# EAGLE design NAV_Doska_2 (EAGLE 7.2.0)
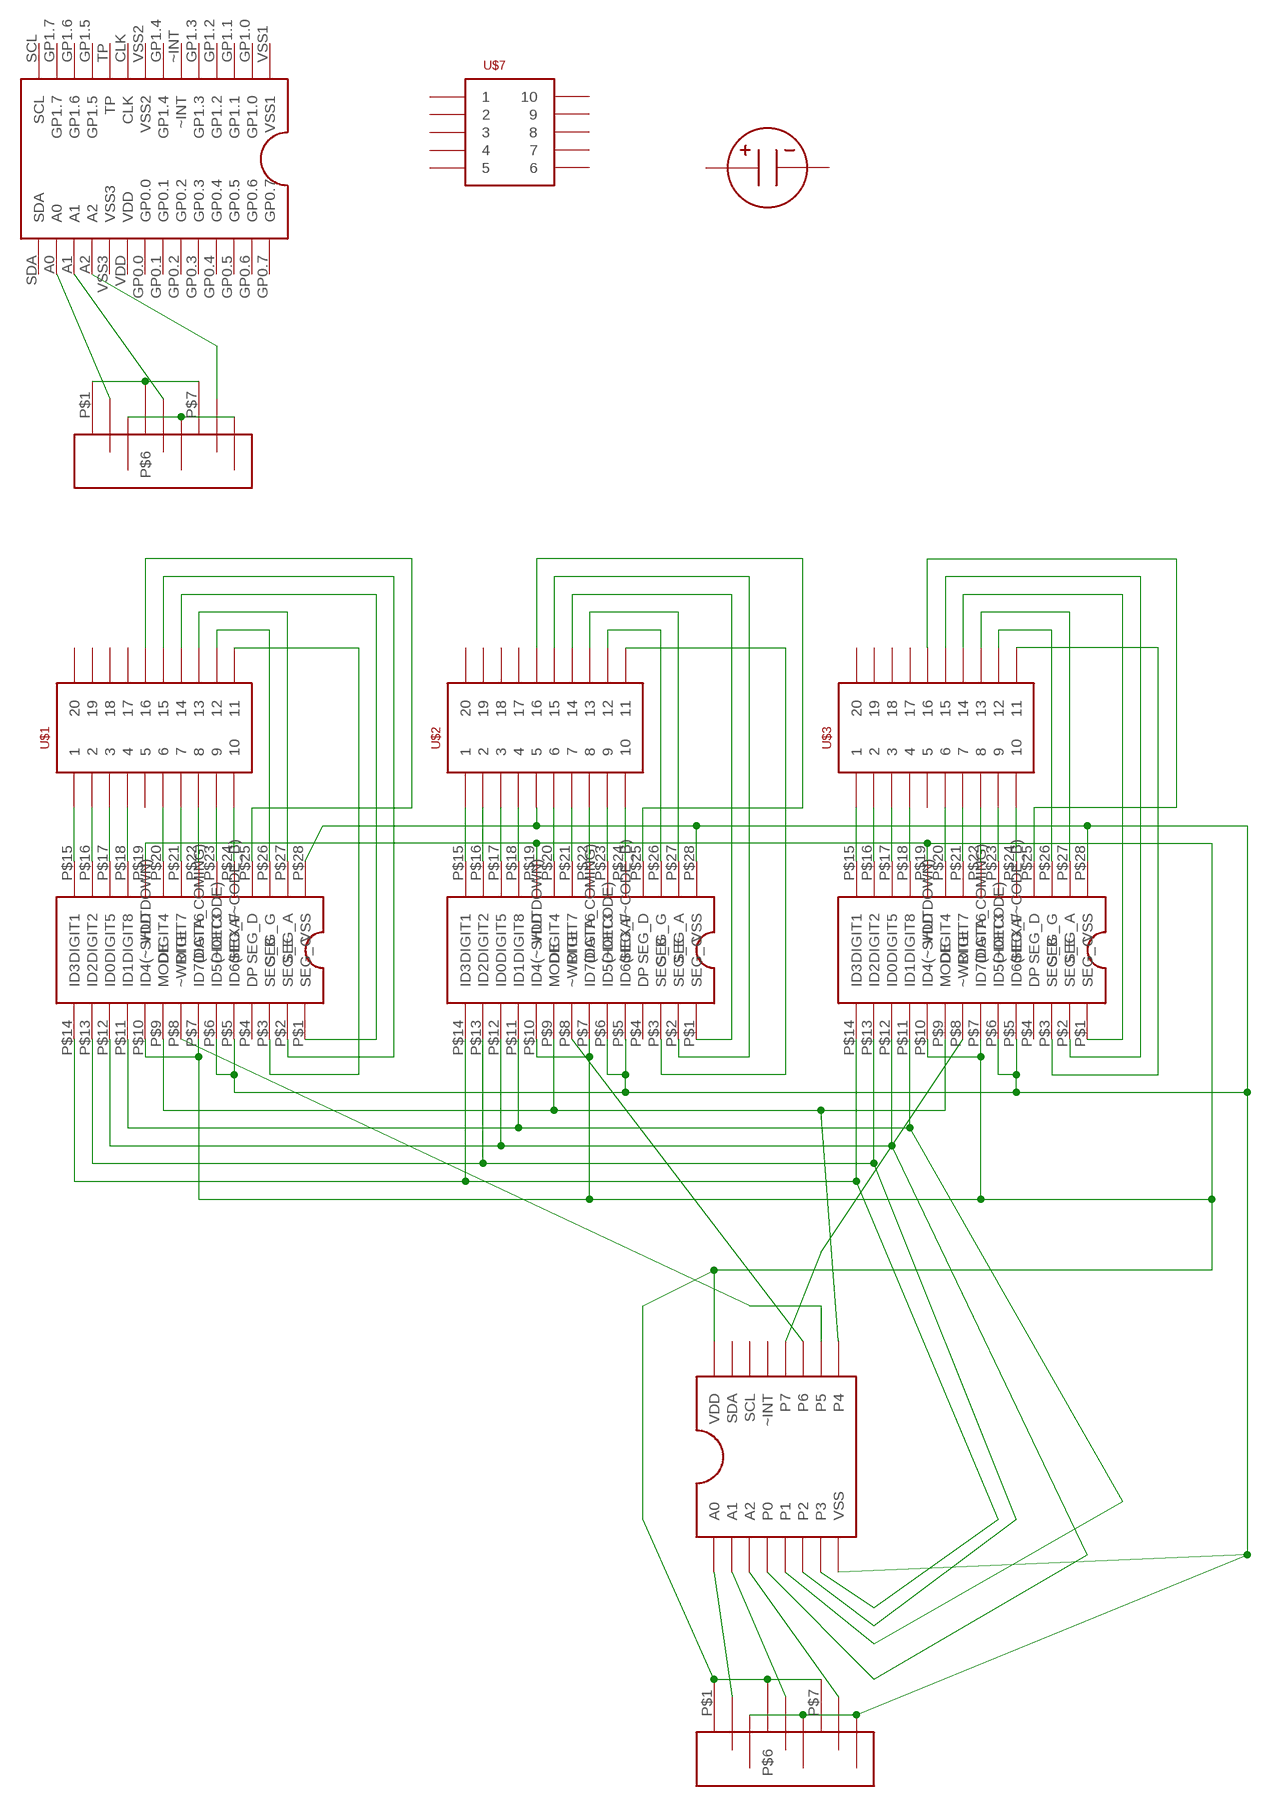
[diagram p0: schematic, sheet 1]

## Parts
U$1  LISTA_2X10  [LISTA_2X10]
U$2  LISTA_2X10  [LISTA_2X10]
U$3  LISTA_2X10  [LISTA_2X10]
U$4  ICM7228A  [ICM7228A]
U$5  ICM7228A  [ICM7228A]
U$6  ICM7228A  [ICM7228A]
U$7  LISTA_2X5  [LISTA_2X5]
U$8  MCP23016  [MCP23016]
U$9  PCF8574A  [PCF8574A]
U$10  ADRESA_0..2  [ADRESA_0..2]
U$11  ADRESA_0..2  [ADRESA_0..2]
U$12  KONDENZATOR_  [KONDENZATOR_]

## Nets
GND: U$2.5 U$4.P$5(ID6(HEXA/~CODE_B)) U$4.P$6(ID5(~DECODE)) U$4.P$28(VSS) U$5.P$5(ID6(HEXA/~CODE_B)) U$5.P$6(ID5(~DECODE)) U$5.P$28(VSS) U$6.P$5(ID6(HEXA/~CODE_B)) U$6.P$6(ID5(~DECODE)) U$6.P$28(VSS) U$9.VSS U$11.P$3 U$11.P$4 U$11.P$9
N$1: U$1.1 U$4.P$15(DIGIT1)
N$2: U$2.1 U$5.P$15(DIGIT1)
N$3: U$1.2 U$4.P$16(DIGIT2)
N$4: U$1.3 U$4.P$17(DIGIT5)
N$5: U$1.4 U$4.P$18(DIGIT8)
N$6: U$1.11 U$4.P$3(SEG_B)
N$7: U$1.6 U$4.P$20(DIGIT4)
N$8: U$1.7 U$4.P$21(DIGIT7)
N$9: U$1.8 U$4.P$22(DIGIT6)
N$10: U$1.9 U$4.P$23(DIGIT3)
N$11: U$1.10 U$4.P$24(SEG_F)
N$12: U$1.12 U$4.P$26(SEG_G)
N$13: U$1.13 U$4.P$27(SEG_A)
N$14: U$2.2 U$5.P$16(DIGIT2)
N$15: U$2.3 U$5.P$17(DIGIT5)
N$16: U$2.4 U$5.P$18(DIGIT8)
N$17: U$3.1 U$6.P$15(DIGIT1)
N$18: U$2.6 U$5.P$20(DIGIT4)
N$19: U$2.7 U$5.P$21(DIGIT7)
N$20: U$2.8 U$5.P$22(DIGIT6)
N$21: U$2.9 U$5.P$23(DIGIT3)
N$22: U$2.10 U$5.P$24(SEG_F)
N$23: U$3.2 U$6.P$16(DIGIT2)
N$24: U$3.3 U$6.P$17(DIGIT5)
N$25: U$3.4 U$6.P$18(DIGIT8)
N$26: U$3.6 U$6.P$20(DIGIT4)
N$27: U$3.7 U$6.P$21(DIGIT7)
N$28: U$3.8 U$6.P$22(DIGIT6)
N$29: U$3.9 U$6.P$23(DIGIT3)
N$30: U$3.10 U$6.P$24(SEG_F)
N$31: U$2.16 U$5.P$25(SEG_D)
N$32: U$2.12 U$5.P$26(SEG_G)
N$33: U$2.13 U$5.P$27(SEG_A)
N$34: U$3.16 U$6.P$25(SEG_D)
N$35: U$3.12 U$6.P$26(SEG_G)
N$36: U$3.13 U$6.P$27(SEG_A)
N$37: U$1.14 U$4.P$1(SEG_C)
N$38: U$1.15 U$4.P$2(SEG_E)
N$39: U$1.16 U$4.P$25(SEG_D)
N$40: U$4.P$14(ID3) U$5.P$14(ID3) U$6.P$14(ID3) U$9.P3
N$41: U$4.P$13(ID2) U$5.P$13(ID2) U$6.P$13(ID2) U$9.P2
N$42: U$4.P$12(ID0) U$5.P$12(ID0) U$6.P$12(ID0) U$9.P0
N$43: U$4.P$11(ID1) U$5.P$11(ID1) U$6.P$11(ID1) U$9.P1
N$44: U$4.P$9(MODE) U$5.P$9(MODE) U$6.P$9(MODE) U$9.P4
N$45: U$2.14 U$5.P$1(SEG_C)
N$46: U$2.15 U$5.P$2(SEG_E)
N$47: U$9.A0 U$11.P$2
N$48: U$3.14 U$6.P$1(SEG_C)
N$49: U$3.15 U$6.P$2(SEG_E)
N$50: U$9.A1 U$11.P$5
N$52: U$3.11 U$6.P$3(SEG_B)
N$53: U$2.11 U$5.P$3(SEG_B)
N$54: U$10.P$3 U$10.P$4 U$10.P$9
N$55: U$9.A2 U$11.P$8
N$56: U$8.A0 U$10.P$2
N$57: U$8.A1 U$10.P$5
N$58: U$8.A2 U$10.P$8
N$59: U$10.P$1 U$10.P$6 U$10.P$7
N$60: U$6.P$8(~WRITE) U$9.P7
N$61: U$5.P$8(~WRITE) U$9.P6
N$62: U$4.P$8(~WRITE) U$9.P5
N$64: U$4.P$7(ID7(DATA_COMING)) U$4.P$10(ID4(~SHUTDOWN)) U$4.P$19(VDD) U$5.P$7(ID7(DATA_COMING)) U$5.P$10(ID4(~SHUTDOWN)) U$5.P$19(VDD) U$6.P$7(ID7(DATA_COMING)) U$6.P$10(ID4(~SHUTDOWN)) U$6.P$19(VDD) U$9.VDD U$11.P$1 U$11.P$6 U$11.P$7
Unconnected: U$1.5 U$1.17 U$1.18 U$1.19 U$1.20 U$2.17 U$2.18 U$2.19 U$2.20 U$3.5 U$3.17 U$3.18 U$3.19 U$3.20 U$4.P$4(DP) U$5.P$4(DP) U$6.P$4(DP) U$7.1 U$7.2 U$7.3 U$7.4 U$7.5 U$7.6 U$7.7 U$7.8 U$7.9 U$7.10 U$8.CLK U$8.GP0.0 U$8.GP0.1 U$8.GP0.2 U$8.GP0.3 U$8.GP0.4 U$8.GP0.5 U$8.GP0.6 U$8.GP0.7 U$8.GP1.0 U$8.GP1.1 U$8.GP1.2 U$8.GP1.3 U$8.GP1.4 U$8.GP1.5 U$8.GP1.6 U$8.GP1.7 U$8.SCL U$8.SDA U$8.TP U$8.VDD U$8.VSS1 U$8.VSS2 U$8.VSS3 U$8.~INT U$9.SCL U$9.SDA U$9.~INT U$12.P$1 U$12.P$2

## Library data of the parts
U$1-U$3 = RadioStack_v2:LISTA_2X10
U$4-U$6 = RadioStack_v2:ICM7228A
U$7 = RadioStack_v2:LISTA_2X5
U$8 = RadioStack_v2:MCP23016
U$9 = RadioStack_v2:PCF8574A
U$10 U$11 = RadioStack_v2:ADRESA_0..2
U$12 = RadioStack_v2:KONDENZATOR_

## Board
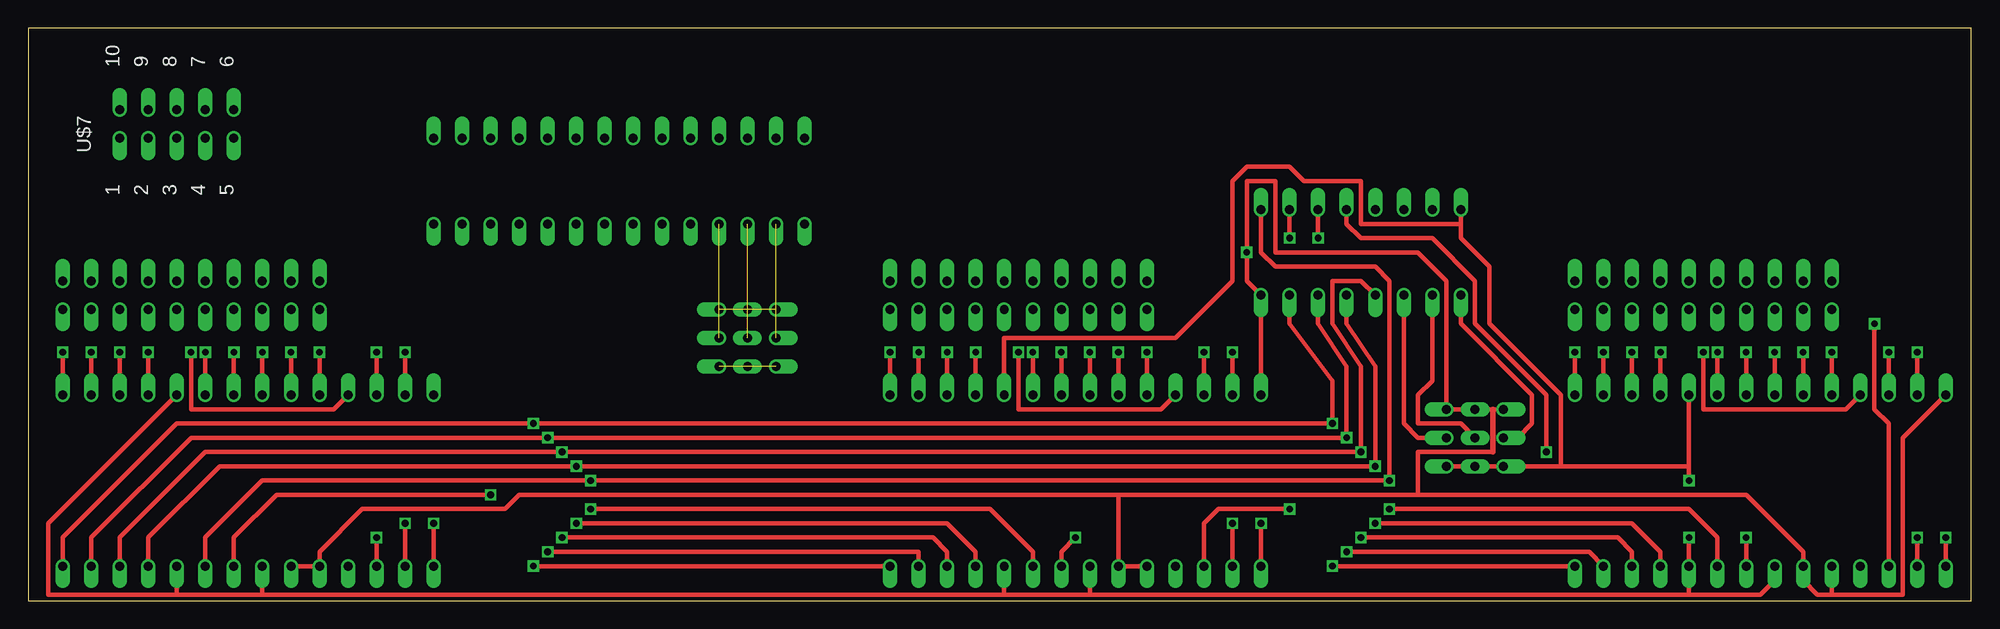
[diagram p1: board, top side]
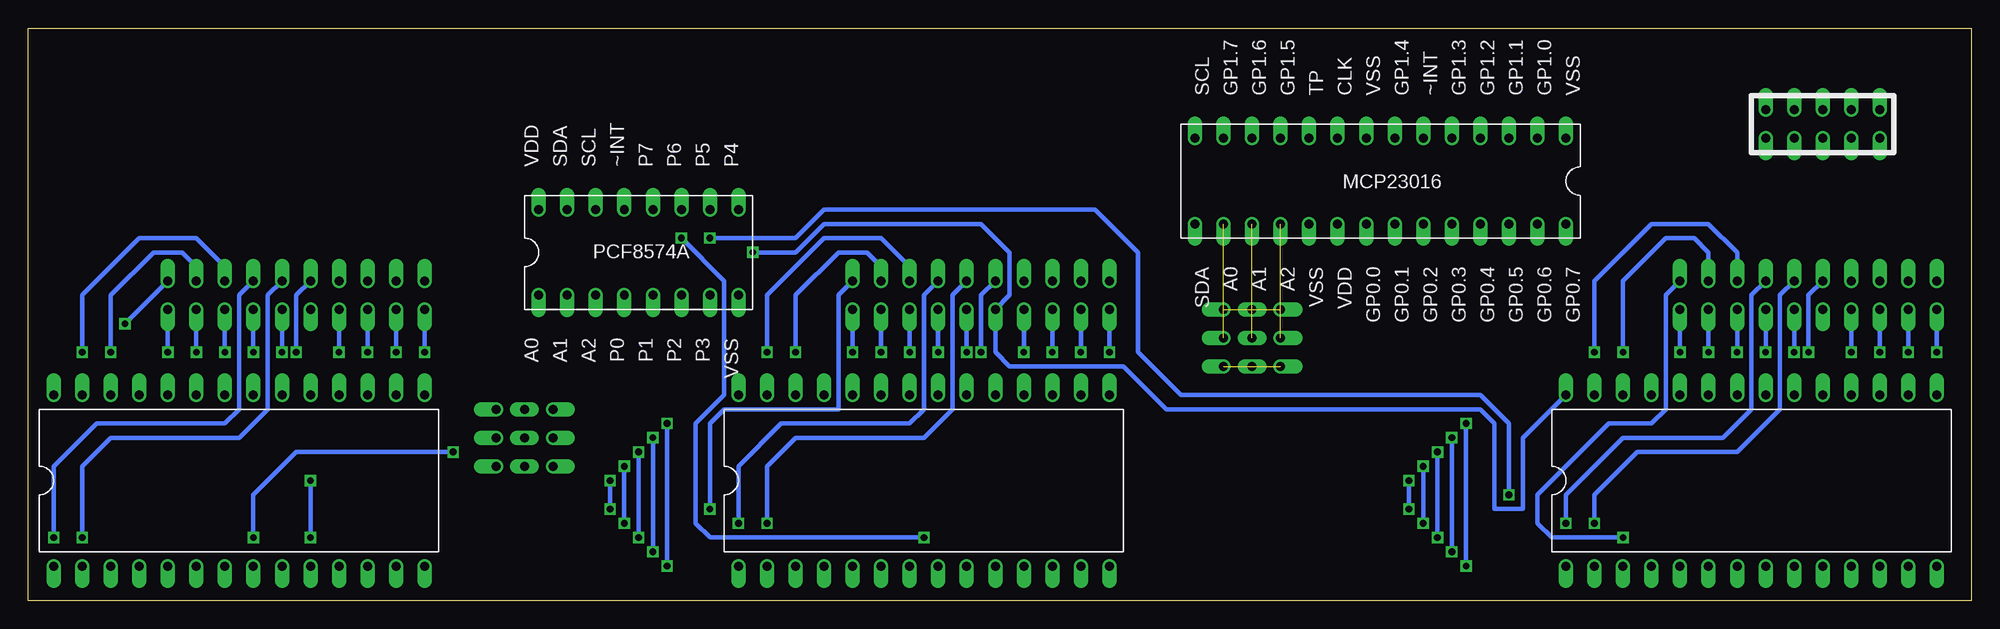
[diagram p2: board, bottom side, seen from below]

Size 173 x 51 mm. Coordinates in mm from the lower left corner, seen from the top.
Outline: 0,51 0,0 173,0 173,51 0,51
Copper layers (1*16): Top 0.035mm / dielectric 1.5mm / Bottom 0.035mm
Design rules "RadioStack_v2 *": minimum track width 0.2mm, minimum drill 0.4mm, track to track 0.2mm, track to pad 0.2mm, pad to pad 0.2mm, via to via 0.2mm, smd to smd 0.2mm, copper to edge 0.2mm, drill to drill 8mil, minimum pad ring 10mil, minimum via ring 8mil, stop-mask expansion 4mil, vias tented up to drill 0mil, thermal gap 10mil

### Footprints (pad centres in the part's own frame; a part is rotated, then mirrored left to right if it is on the bottom)
LISTA_2X10 = drill 0.8 pad 1.27 offset: 1 0,0; 2 0,-2.54; 3 0,-5.08; 4 0,-7.62; 5 0,-10.16; 6 0,-12.7; 7 0,-15.24; 8 0,-17.78; 9 0,-20.32; 10 0,-22.86; 11 2.54,-22.86; 12 2.54,-20.32; 13 2.54,-17.78; 14 2.54,-15.24; 15 2.54,-12.7; 16 2.54,-10.16; 17 2.54,-7.62; 18 2.54,-5.08; 19 2.54,-2.54; 20 2.54,0
ICM7228A = drill 0.8 pad 1.27 offset: P$1 0,0; P$2 0,-2.54 | drill 0.8 offset: P$3 0,-5.08; P$4 0,-7.62; P$5 0,-10.16; P$6 0,-12.7; P$7 0,-15.24; P$8 0,-17.78; P$9 0,-20.32; P$10 0,-22.86; P$11 0,-25.4; P$12 0,-27.94; P$13 0,-30.48; P$14 0,-33.02; P$15 15.24,-33.02; P$16 15.24,-30.48; P$17 15.24,-27.94; P$18 15.24,-25.4; P$19 15.24,-22.86; P$20 15.24,-20.32; P$21 15.24,-17.78; P$22 15.24,-15.24; P$23 15.24,-12.7; P$24 15.24,-10.16; P$25 15.24,-7.62; P$26 15.24,-5.08; P$27 15.24,-2.54; P$28 15.24,0
LISTA_2X5 = drill 0.8 pad 1.27 offset: 1 0,0; 2 0,-2.54; 3 0,-5.08; 4 0,-7.62; 5 0,-10.16; 6 2.54,-10.16; 7 2.54,-7.62; 8 2.54,-5.08; 9 2.54,-2.54; 10 2.54,0
MCP23016 = drill 0.8 pad 1.27 offset: A0 7.62,-30.48; A1 7.62,-27.94; A2 7.62,-25.4; CLK 0,-20.32; GP0.0 7.62,-17.78; GP0.1 7.62,-15.24; GP0.2 7.62,-12.7; GP0.3 7.62,-10.16; GP0.4 7.62,-7.62; GP0.5 7.62,-5.08; GP0.6 7.62,-2.54; GP0.7 7.62,0; GP1.0 0,-2.54; GP1.1 0,-5.08; GP1.2 0,-7.62; GP1.3 0,-10.16; GP1.4 0,-15.24; GP1.5 0,-25.4; GP1.6 0,-27.94; GP1.7 0,-30.48; SCL 0,-33.02; SDA 7.62,-33.02; TP 0,-22.86; VDD 7.62,-20.32; VSS1 0,0; VSS2 0,-17.78; VSS3 7.62,-22.86; ~INT 0,-12.7
PCF8574A = drill 0.8 pad 1.27 offset: A0 0,0; A1 0,-2.54; A2 0,-5.08; P0 0,-7.62; P1 0,-10.16; P2 0,-12.7; P3 0,-15.24; P4 7.62,-17.78; P5 7.62,-15.24; P6 7.62,-12.7; P7 7.62,-10.16; SCL 7.62,-5.08; SDA 7.62,-2.54; VDD 7.62,0; VSS 0,-17.78; ~INT 7.62,-7.62
ADRESA_0..2 = drill 0.8 offset: P$1 0,0; P$2 0,-2.54; P$3 0,-5.08; P$7 5.08,0; P$8 5.08,-2.54; P$9 5.08,-5.08 | drill 0.8 long: P$4 2.54,-5.08; P$5 2.54,-2.54; P$6 2.54,0
KONDENZATOR_ = drill 0.8 pad 1.27 offset: P$1 -2.54,0; P$2 2.54,0

### Placement (x,y rotation side)
U$1  3.08,25.94 90 top
U$2  76.74,25.94 90 top
U$3  137.7,25.94 90 top
U$4  36.1,3.08 90 bottom
U$5  109.76,3.08 90 bottom
U$6  170.72,3.08 90 bottom
U$7  8.16,41.18 90 top
U$8  36.1,41.18 270 bottom
U$9  127.54,27.21 90 bottom
U$10  66.58,20.86 180 top
U$11  131.35,11.97 180 top
U$12  57.69,-12.16 0 top  (outside the outline)

### Tracks (layer width: path | path; a pad name or v marks a point on that pad's centre or on a via)
GND  (via drill 0.6)
  Top 0.406: U$4.P$6 U$4.P$5 25.94,4.35 29.75,8.16 42.45,8.16 43.72,9.43 97.06,9.43 | U$5.P$5 U$5.P$6 97.06,9.43 | 97.06,9.43 123.73,9.43 | 123.73,9.43 152.94,9.43 158.02,4.35 U$6.P$6 158.02,1.81 159.29,0.54 160.56,0.54 | U$11.P$3 130.4,17.05 U$11.P$4 U$11.P$9 126.27,28.48 123.73,31.02 111.03,31.02 111.03,37.37 108.49,37.37 v108.49,31.02 108.49,28.48 U$9.VSS U$5.P$28 | 160.56,0.54 166.91,0.54 166.91,14.51 U$6.P$28 | 130.4,13.24 123.73,13.24 123.73,9.43 | U$6.P$5 160.56,0.54
  Top 0.5: 130.4,17.05 130.4,13.24
  Bottom 0.406: v108.49,31.02 104.68,31.02 102.14,33.56 88.17,33.56 85.63,31.02 85.63,27.21 U$2.5 86.9,22.13 85.63,20.86 75.47,20.86 71.66,17.05 43.72,17.05 42.45,15.78 42.45,8.16 39.91,8.16 39.91,14.51 U$4.P$28
N$1  (via drill 0.6)
  Top 0.406: v3.08,22.13 U$4.P$15
  Bottom 0.406: U$1.1 v3.08,22.13
N$2  (via drill 0.6)
  Top 0.406: U$5.P$15 v76.74,22.13
  Bottom 0.406: v76.74,22.13 U$2.1
N$3  (via drill 0.6)
  Top 0.406: v5.62,22.13 U$4.P$16
  Bottom 0.406: U$1.2 v5.62,22.13
N$4  (via drill 0.6)
  Top 0.406: v8.16,22.13 U$4.P$17
  Bottom 0.406: U$1.3 v8.16,22.13
N$5  (via drill 0.6)
  Top 0.406: v10.7,22.13 U$4.P$18
  Bottom 0.406: U$1.4 v10.7,22.13
N$6  (via drill 0.6)
  Top 0.406: U$4.P$3 v31.02,5.62
  Bottom 0.406: v31.02,5.62 37.37,5.62 38.64,6.89 38.64,9.43 32.29,15.78 28.48,15.78 27.21,17.05 27.21,27.21 U$1.11
N$7  (via drill 0.6)
  Top 0.406: v15.78,22.13 U$4.P$20
  Bottom 0.406: U$1.6 v15.78,22.13
N$8  (via drill 0.6)
  Top 0.406: v18.32,22.13 U$4.P$21
  Bottom 0.406: U$1.7 v18.32,22.13
N$9  (via drill 0.6)
  Top 0.406: v20.86,22.13 U$4.P$22
  Bottom 0.406: U$1.8 v20.86,22.13
N$10  (via drill 0.6)
  Top 0.406: v23.4,22.13 U$4.P$23
  Bottom 0.406: U$1.9 v23.4,22.13
N$11  (via drill 0.6)
  Top 0.406: v25.94,22.13 U$4.P$24
  Bottom 0.406: U$1.10 v25.94,22.13
N$12  (via drill 0.6)
  Top 0.406: U$4.P$26 v31.02,22.13
  Bottom 0.406: v31.02,22.13 31.02,28.48 27.21,32.29 24.67,32.29 23.4,31.02 U$1.12
N$13  (via drill 0.6)
  Top 0.406: U$4.P$27 v33.56,22.13
  Bottom 0.406: v33.56,22.13 33.56,28.48 28.48,33.56 23.4,33.56 20.86,31.02 U$1.13
N$14  (via drill 0.6)
  Top 0.406: U$5.P$16 v79.28,22.13
  Bottom 0.406: v79.28,22.13 U$2.2
N$15  (via drill 0.6)
  Top 0.406: U$5.P$17 v81.82,22.13
  Bottom 0.406: v81.82,22.13 U$2.3
N$16  (via drill 0.6)
  Top 0.406: U$5.P$18 v84.36,22.13
  Bottom 0.406: v84.36,22.13 U$2.4
N$17  (via drill 0.6)
  Top 0.406: U$6.P$15 v137.7,22.13
  Bottom 0.406: v137.7,22.13 U$3.1
N$18  (via drill 0.6)
  Top 0.406: U$5.P$20 v89.44,22.13
  Bottom 0.406: v89.44,22.13 U$2.6
N$19  (via drill 0.6)
  Top 0.406: U$5.P$21 v91.98,22.13
  Bottom 0.406: v91.98,22.13 U$2.7
N$20  (via drill 0.6)
  Top 0.406: U$5.P$22 v94.52,22.13
  Bottom 0.406: v94.52,22.13 U$2.8
N$21  (via drill 0.6)
  Top 0.406: U$5.P$23 v97.06,22.13
  Bottom 0.406: v97.06,22.13 U$2.9
N$22  (via drill 0.6)
  Top 0.406: U$5.P$24 v99.6,22.13
  Bottom 0.406: v99.6,22.13 U$2.10
N$23  (via drill 0.6)
  Top 0.406: U$6.P$16 v140.24,22.13
  Bottom 0.406: v140.24,22.13 U$3.2
N$24  (via drill 0.6)
  Top 0.406: U$6.P$17 v142.78,22.13
  Bottom 0.406: v142.78,22.13 U$3.3
N$25  (via drill 0.6)
  Top 0.406: U$6.P$18 v145.32,22.13
  Bottom 0.406: v145.32,22.13 U$3.4
N$26  (via drill 0.6)
  Top 0.406: U$6.P$20 v150.4,22.13
  Bottom 0.406: v150.4,22.13 U$3.6
N$27  (via drill 0.6)
  Top 0.406: U$6.P$21 v152.94,22.13
  Bottom 0.406: v152.94,22.13 U$3.7
N$28  (via drill 0.6)
  Top 0.406: U$6.P$22 v155.48,22.13
  Bottom 0.406: v155.48,22.13 U$3.8
N$29  (via drill 0.6)
  Top 0.406: U$6.P$23 v158.02,22.13
  Bottom 0.406: v158.02,22.13 U$3.9
N$30  (via drill 0.6)
  Top 0.406: U$6.P$24 v160.56,22.13
  Bottom 0.406: v160.56,22.13 U$3.10
N$31  (via drill 0.6)
  Top 0.406: U$5.P$25 100.87,17.05 88.17,17.05 v88.17,22.13
  Bottom 0.406: v88.17,22.13 88.17,27.21 U$2.16
N$32  (via drill 0.6)
  Top 0.406: U$5.P$26 v104.68,22.13
  Bottom 0.406: v104.68,22.13 104.68,27.21 100.87,31.02 98.33,31.02 97.06,29.75 U$2.12
N$33  (via drill 0.6)
  Top 0.406: U$5.P$27 v107.22,22.13
  Bottom 0.406: v107.22,22.13 107.22,27.21 102.14,32.29 97.06,32.29 94.52,29.75 U$2.13
N$34  (via drill 0.6)
  Top 0.406: U$6.P$25 161.83,17.05 149.13,17.05 v149.13,22.13
  Bottom 0.406: v149.13,22.13 149.13,27.21 U$3.16
N$35  (via drill 0.6)
  Top 0.406: U$6.P$26 v165.64,22.13
  Bottom 0.406: v165.64,22.13 165.64,27.21 161.83,31.02 159.29,31.02 158.02,29.75 U$3.12
N$36  (via drill 0.6)
  Top 0.406: U$6.P$27 v168.18,22.13
  Bottom 0.406: v168.18,22.13 168.18,27.21 163.1,32.29 158.02,32.29 155.48,29.75 U$3.13
N$37  (via drill 0.6)
  Top 0.406: U$4.P$1 v36.1,6.89
  Bottom 0.406: v36.1,6.89 36.1,9.43 31.02,14.51 22.13,14.51 19.59,17.05 19.59,27.21 U$1.14
N$38  (via drill 0.6)
  Top 0.406: U$4.P$2 v33.56,6.89
  Bottom 0.406: v33.56,6.89 33.56,9.43 29.75,13.24 20.86,13.24 17.05,17.05 17.05,27.21 U$1.15
N$39  (via drill 0.6)
  Top 0.406: U$4.P$25 27.21,17.05 14.51,17.05 v14.51,22.13
  Bottom 0.406: v14.51,22.13 14.51,27.21 U$1.16
N$40  (via drill 0.6)
  Top 0.406: U$6.P$14 v116.11,3.08 | U$4.P$14 3.08,5.62 13.24,15.78 v44.99,15.78 v116.11,15.78 116.11,19.59 112.3,24.67 U$9.P3 | v44.99,3.08 U$5.P$14
  Bottom 0.406: v44.99,15.78 v44.99,3.08 | v116.11,3.08 v116.11,15.78
N$41  (via drill 0.6)
  Top 0.406: U$6.P$13 138.97,4.35 v117.38,4.35 | U$4.P$13 5.62,5.62 14.51,14.51 v46.26,14.51 v117.38,14.51 117.38,20.86 114.84,24.67 U$9.P2 | v46.26,4.35 79.28,4.35 U$5.P$13
  Bottom 0.406: v46.26,14.51 v46.26,4.35 | v117.38,4.35 v117.38,14.51
N$42  (via drill 0.6)
  Top 0.406: U$6.P$12 142.78,4.35 141.51,5.62 v118.65,5.62 | U$4.P$12 8.16,5.62 15.78,13.24 v47.53,13.24 v118.65,13.24 118.65,20.86 116.11,24.67 116.11,28.48 118.65,28.48 U$9.P0 | v47.53,5.62 80.55,5.62 81.82,4.35 U$5.P$12
  Bottom 0.406: v47.53,13.24 v47.53,5.62 | v118.65,5.62 v118.65,13.24
N$43  (via drill 0.6)
  Top 0.406: U$6.P$11 145.32,4.35 142.78,6.89 v119.92,6.89 | U$4.P$11 10.7,5.62 17.05,11.97 v48.8,11.97 v119.92,11.97 119.92,20.86 117.38,24.67 U$9.P1 | U$5.P$11 84.36,4.35 81.82,6.89 v48.8,6.89
  Bottom 0.406: v48.8,11.97 v48.8,6.89 | v119.92,11.97 v119.92,6.89
N$44  (via drill 0.6)
  Top 0.406: U$4.P$9 15.78,5.62 20.86,10.7 v50.07,10.7 v121.19,10.7 121.19,28.48 119.92,29.75 111.03,29.75 109.76,31.02 U$9.P4 | U$5.P$9 89.44,4.35 85.63,8.16 v50.07,8.16 | U$6.P$9 150.4,5.62 147.86,8.16 v121.19,8.16
  Bottom 0.406: v121.19,8.16 v121.19,10.7 | v50.07,10.7 v50.07,8.16
N$45  (via drill 0.6)
  Top 0.406: U$5.P$1 v109.76,6.89
  Bottom 0.406: v109.76,6.89 109.76,11.97 105.95,15.78 94.52,15.78 93.25,17.05 93.25,27.21 U$2.14
N$46  (via drill 0.6)
  Top 0.406: U$5.P$2 v107.22,6.89
  Bottom 0.406: U$2.15 90.71,27.21 90.71,17.05 93.25,14.51 104.68,14.51 107.22,11.97 v107.22,6.89
N$47
  Top 0.406: U$11.P$2 132.62,14.51 133.89,15.78 133.89,18.32 127.54,24.67 U$9.A0
N$48  (via drill 0.6)
  Top 0.406: U$6.P$1 v170.72,5.62
  Bottom 0.406: U$3.14 154.21,27.21 154.21,17.05 155.48,15.78 166.91,15.78 170.72,11.97 v170.72,5.62
N$49  (via drill 0.6)
  Top 0.406: U$6.P$2 v168.18,5.62
  Bottom 0.406: U$3.15 151.67,27.21 151.67,17.05 154.21,14.51 165.64,14.51 168.18,11.97 v168.18,5.62
N$50
  Top 0.406: U$11.P$5 127.54,15.78 123.73,15.78 123.73,18.32 125,19.59 U$9.A1
N$52  (via drill 0.6)
  Top 0.406: U$6.P$3 165.64,15.78 164.37,17.05 v164.37,24.67
  Bottom 0.406: v164.37,24.67 U$3.11
N$53  (via drill 0.6)
  Top 0.406: U$5.P$3 104.68,6.89 105.95,8.16 v112.3,8.16
  Bottom 0.406: v112.3,8.16 112.3,15.78 111.03,17.05 100.87,17.05 100.87,27.21 U$2.11
N$54  (2 unrouted)
N$55
  Top 0.406: U$9.A2 122.46,15.78 123.73,14.51 U$11.P$8
N$56  (1 unrouted)
N$57  (1 unrouted)
N$58  (1 unrouted)
N$59  (2 unrouted)
N$60  (via drill 0.6)
  Top 0.406: U$6.P$8 v152.94,5.62 | v135.16,13.24 135.16,18.32 128.81,24.67 128.81,28.48 125,32.29 118.65,32.29 117.38,33.56 U$9.P7
  Bottom 0.406: v152.94,5.62 152.94,9.43 149.13,13.24 v135.16,13.24
N$61  (via drill 0.6)
  Top 0.406: U$5.P$8 91.98,4.35 v93.25,5.62 | v114.84,32.29 U$9.P6
  Bottom 0.406: v93.25,5.62 112.3,5.62 113.57,6.89 113.57,15.78 111.03,18.32 111.03,28.48 v114.84,32.29
N$62  (via drill 0.6)
  Top 0.406: U$4.P$8 18.32,5.62 22.13,9.43 v41.18,9.43 | v112.3,32.29 U$9.P5
  Bottom 0.406: v41.18,9.43 41.18,15.78 43.72,18.32 70.39,18.32 74.2,22.13 74.2,31.02 78.01,34.83 102.14,34.83 104.68,32.29 v112.3,32.29
N$64  (via drill 0.6)
  Top 0.406: U$6.P$7 155.48,1.81 154.21,0.54 147.86,0.54 | 147.86,0.54 U$6.P$10 v147.86,5.62 | 147.86,0.54 94.52,0.54 | U$5.P$7 94.52,0.54 | 94.52,0.54 86.9,0.54 | U$5.P$10 86.9,0.54 | 86.9,0.54 20.86,0.54 | U$4.P$7 20.86,0.54 | 20.86,0.54 13.24,0.54 | 13.24,0.54 U$4.P$10 | U$11.P$7 U$11.P$6 U$11.P$1 136.43,11.97 | v147.86,10.7 147.86,11.97 | 147.86,11.97 U$6.P$19 | 136.43,11.97 147.86,11.97 | U$9.VDD 127.54,33.56 | 127.54,33.56 127.54,32.29 130.08,29.75 130.08,24.67 136.43,18.32 136.43,11.97 | U$4.P$19 1.81,6.89 1.81,0.54 13.24,0.54 | U$5.P$19 86.9,23.4 102.14,23.4 107.22,28.48 107.22,37.37 108.49,38.64 112.3,38.64 113.57,37.37 118.65,37.37 118.65,33.56 127.54,33.56
  Bottom 0.406: v147.86,5.62 v147.86,10.7

### Text on the board
Document: - 2x vyber adries / - 6x kondenzator - tlacitka / - upravit rozmiestnenie / - skontrolovat VCC/VSS a GND / - pridat jeden vystupny konektor (NAV1/NAV2)